# EAGLE design ADS124S08-Dev-Board (EAGLE 9.6.2)
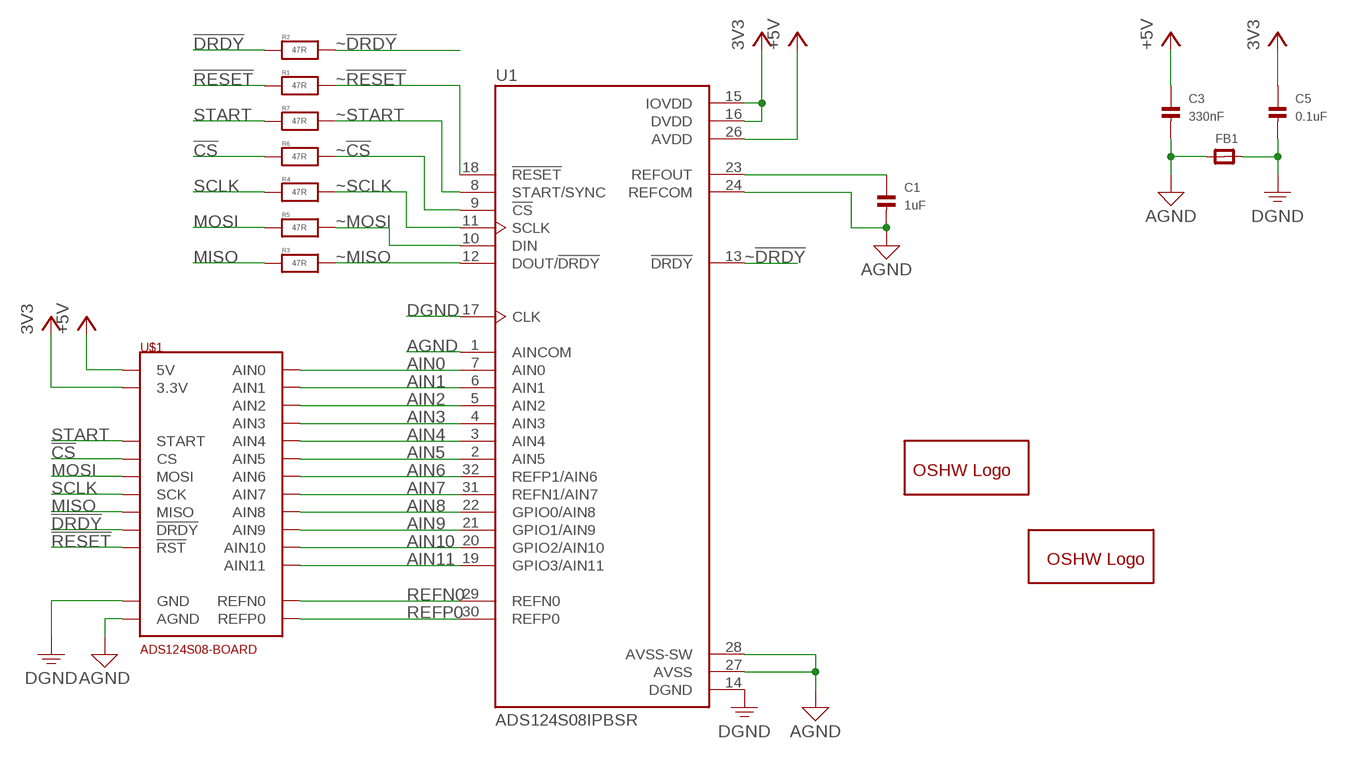
[diagram p0: schematic, sheet 1]

## Parts
C1  1uF  CAP_CERAMIC0603MINI  [C0603-MINI]
C3  330nF  CAP_CERAMIC0603MINI  [C0603-MINI]
C5  0.1uF  CAP_CERAMIC0603MINI  [C0603-MINI]
FB1  FERRITE_0603  [_0603]
GOLD_ORB_SM1  OSHWLOGOLOGO5MM  [OSHW_5MM]
GOLD_ORB_SM2  OSHWLOGOLOGO8MM  [OSHW_8MM]
R1  47R  RESISTOR0603MINI  [R0603-MINI]
R2  47R  RESISTOR0603MINI  [R0603-MINI]
R3  47R  RESISTOR0603MINI  [R0603-MINI]
R4  47R  RESISTOR0603MINI  [R0603-MINI]
R5  47R  RESISTOR0603MINI  [R0603-MINI]
R6  47R  RESISTOR0603MINI  [R0603-MINI]
R7  47R  RESISTOR0603MINI  [R0603-MINI]
U1  ADS124S08IPBSR  [QFP50P700X700X120-32N]
U$1  ADS124S08-BOARD  [ADS124S08-BOARD]

## Nets
3V3: C5.1 U1.15(IOVDD) U1.16(DVDD) U$1.15(3.3V)
!CS: R6.1 U$1.21(CS)
!DRDY: R2.1 U$1.17(!DRDY)
!RESET: R1.1 U$1.16(!RST)
+5V: C3.1 U1.26(AVDD) U$1.14(5V)
AGND: C1.2 C3.2 FB1.1 U1.1(AINCOM) U1.24(REFCOM) U1.27(AVSS) U1.28(AVSS-SW) U$1.25(AGND)
AIN0: U1.7(AIN0) U$1.12(AIN0)
AIN1: U1.6(AIN1) U$1.11(AIN1)
AIN2: U1.5(AIN2) U$1.10(AIN2)
AIN3: U1.4(AIN3) U$1.9(AIN3)
AIN4: U1.3(AIN4) U$1.8(AIN4)
AIN5: U1.2(AIN5) U$1.7(AIN5)
AIN6: U1.32(REFP1/AIN6) U$1.6(AIN6)
AIN7: U1.31(REFN1/AIN7) U$1.5(AIN7)
AIN8: U1.22(GPIO0/AIN8) U$1.4(AIN8)
AIN9: U1.21(GPIO1/AIN9) U$1.3(AIN9)
AIN10: U1.20(GPIO2/AIN10) U$1.2(AIN10)
AIN11: U1.19(GPIO3/AIN11) U$1.1(AIN11)
DGND: C5.2 FB1.2 U1.14(DGND) U1.17(CLK) U$1.13(GND) U$1.26(GND)
MISO: R3.1 U$1.18(MISO)
MOSI: R5.1 U$1.20(MOSI)
N$7: C1.1 U1.23(REFOUT)
REFN0: U1.29(REFN0) U$1.23(REFN0)
REFP0: U1.30(REFP0) U$1.24(REFP0)
SCLK: R4.1 U$1.19(SCK)
START: R7.1 U$1.22(START)
~!CS: R6.2 U1.9(!CS)
~!DRDY: R2.2 U1.13(!DRDY)
~!RESET: R1.2 U1.18(!RESET)
~MISO: R3.2 U1.12(DOUT/!DRDY)
~MOSI: R5.2 U1.10(DIN)
~SCLK: R4.2 U1.11(SCLK)
~START: R7.2 U1.8(START/SYNC)

## Library data of the parts
C1 C3 C5 = eventHorizon:CAP_CERAMIC: Ceramic Capacitors 0402 - 0402 Surface Mount Capacitors 16pF 50V 5% [Digikey: 445-4899-2-ND] 18pF 50V 5% [Digikey: 490-1281-2-ND] 22pF 50V 5% [Digikey: 490-1283-2-ND] 68pF 50V 5% [Digikey: 490-1289-2-ND] 0.1uF 10V 10% [Digikey: 490-1318-2-ND] 1.0uF 6.3V 10% [Digikey: 490-1320-2-ND] 0603 - 0603 Surface Mount Capacitors 16 pF 50V 5% [Digikey: 445-5051-2-ND] 22 pF 50V [Digikey: PCC220ACVTR-ND] 33 pF 50V 5% [Digikey: 490-1415-1-ND] 56pF 50V 5% [Digikey: 490-1421-1-ND] 220pF 50V 5% [Digikey: 445-1285-1-ND] 680 pF 50V 2200 pF 50V 5% C0G [Digikey: 445-1297-1-ND] 5600 pF 100V 5% X7R [Digikey: 478-3711-1-ND] 0.1 µF 25V 10% [Digikey: PCC2277TR-ND] 0.22 µF 16V 10% X7R [Digikey: 445-1318-1-ND] 1.0 µF 25V 10% [Digikey: 445-5146-2-ND] 0603 - RF Specific 3pF 250V +/-0.1pF RF [Digikey: 712-1347-1-ND] 18 pF 250V 5% [Digikey: 478-3505-1-ND or 712-1322-1-ND] 56 pF 250V 5% C0G RF [Digikey: 490-4867-1-ND] 68 pF 250V RF [Digikey: 490-4868-1-ND] 0805 - 0805 Surface Mount Capacitors 220 pF 250V 2% RF Ceramic Capacitor [Digikey: 712-1398-1-ND] 1000 pF 50V 2% NP0 Ceramic Capacitor [Digikey: 478-3760-1-ND] 0.1 µF 25V 10% Ceramic Capacitor [Digikey: PCC1828TR-ND] 1.0 µF 16V 10% Ceramic Capacitor[Digikey: 490-1691-2-ND] 10.0 µF 10V 10% Ceramic Capacitor[Digikey: 709-1228-1-ND] 10.0 uF 16V 10% Ceramic Capacitor [Digikey: 478-5165-2-ND] 47 uF 6.3V 20% Ceramic Capacitor [Digikey: 587-1779-1-ND or 399-5506-1-ND] 1206 - 1206 Surface Mount Capacitors 47uF 10V 20% Ceramic Capacitor [Digikey: 490-5528-1-ND or 399-5508-1-ND or 445-6010-1-ND] 100uF 6.3V -20%, +80% Y5V Ceramic Capacitor (Digikey: 490-4512-1-ND, Mouser: 81-GRM31CF50J107ZE1L); MF: AVX; MPN: 08055C104JAT2A; OC_FARNELL: 1740673
FB1 = electroShri:FERRITE: Ferrite Bead 0603 MMZ1608B121C - 120 Ohm @ 100MHz, 600mA, 0.15 Ohm DC Resistance - Digikey: 445-2164-1-ND BK1608HW121-T - 120 Ohm, 600mA Ferrite Chip - Digikey: 587-1876-2-ND 0805 HZ0805B272R-10 - 2.7K Ohm @ 100MHz, 200mA, 0.8 Ohm DC Resistance - Digikey: 240-2504-1-ND (see also Murata BLM21BD272SN1L) MMZ2012Y152B - 1.5K Ohm @ 100MHz, 500mA, 0.4 Ohm DC Resistance - Digikey: 445-1560-1-ND - Mainly for high frequency (80-400MHz) MMZ2012R102A - 1K Ohm @ 100MHz, 500mA, 0.3 Ohm DC Resistance - Digikey: 445-1555-2-ND - More general purpose (10-200MHz)
GOLD_ORB_SM1 GOLD_ORB_SM2 = electroShri:OSHWLOGO: The OSHW logo for PCB layout
R1-R7 = eventHorizon:RESISTOR: Resistors 0402 - 0402 Surface Mount Package 22 Ohm 1% 1/16W [Digikey: 311-22.0LRTR-ND] 33 Ohm 5% 1/16W 1.0K 5% 1/16W 1.5K 5% 1/16W 2.0K 1% 1/16W 10.0K 1% 1/16W [Digikey: 311-10.0KLRTR-ND] 10.0K 5% 1/16W [Digikey: RMCF0402JT10K0TR-ND] 12.1K 1% 1/16W [Digikey: 311-22.0LRTR-ND] 100.0K 5% 1/16W 0603 - 0603 Surface Mount Package 0 Ohm 1/10 Watt 1% Resistor 15 Ohm 1/10 Watt 1% Resistor 33 Ohm 1/10 Watt 1% Resistor 49.9 Ohm 1/10 Watt 1% Resistor 100 Ohm 1/10 Watt 1% Resistor 150 Ohm 1/10 Watt 1% Resistor 240 Ohm 1/10 Watt 1% Resistor 390 Ohm 1/10 Watt 1% Resistor 560 Ohm 1/10 Watt 1% Resistor 680 Ohm 1/10 Watt 1% Resistor 750 Ohm 1/10 Watt 1% Resistor 1.0K Ohm 1/10 Watt 1% Resistor 1.5K Ohm 1/10 Watt 1% Resistor 2.0K Ohm 1/10 Watt 1% Resistor 2.2K Ohm 1/10 Watt 1% Resistor 3.3K Ohm 1/10 Watt 1% Resistor 4.7K Ohm 1/10 Watt 1% Resistor 10.0K Ohm 1/10 Watt 1% Resistor 12.0K Ohm 1/10 Watt 1% Resistor 12.1K Ohm 1/10 Watt 1% Resistor 20.0K Ohm 1/10 Watt 1% Resistor 33.0K Ohm 1/10 Watt 1% Resistor 100.0K Ohm 1/10 Watt 1% Resistor 0805 - 0805 Surface Mount Package 0 Ohm 1/8 Watt 1% Resistor 33 Ohm 1/8 Watt 1% Resistor 100 Ohm 1/8 Watt 1% Resistor 150 Ohm 1/8 Watt 1% Resistor 200 Ohm 1/8 Watt 1% Resistor 240 Ohm 1/8 Watt 1% Resistor 330 Ohm 1/8 Watt 1% Resistor 390 Ohm 1/8 Watt 1% Resistor 470 Ohm 1/8 Watt 1% Resistor 1.0K Ohm 1/8 Watt 1% Resistor 1.5K Ohm 1/8 Watt 1% Resistor 2.0K Ohm 1/8 Watt 1% Resistor 4.7K Ohm 1/8 Watt 1% Resistor 5.1K Ohm 1/8 Watt 1% Resistor 5.6K Ohm 1/8 Watt 1% Resistor 10.0K Ohm 1/8 Watt 1% Resistor 22.0K Ohm 1/8 Watt 1% Resistor 33.0K Ohm 1/8 Watt 1% Resistor 100K Ohm 1/8 Watt 1% Resistor 1206 - 1206 Surface Mount Package 2012 - 2010 Surface Mount Package 0.11 Ohm 1/2 Watt 1% Resistor - Digikey: RHM.11UCT-ND
U1 = electroShri:ADS124S08IPBSR: 24-Bit, 4kSPS, 12-Ch Delta-Sigma ADC With PGA and VREF for Precision Sensor Measurement 32-TQFP -50 to 125 Check prices <https://pricing.snapeda.com/search/part/ADS124S08IPBSR/?ref=eda>; AVAILABILITY: Good; DESCRIPTION: 24-bit, 4-kSPS, 12-ch delta-sigma ADC with PGA and voltage reference for sensor measurement 32-TQFP -50 to 125; MF: Texas Instruments; MP: ADS124S08IPBSR; PACKAGE: TQFP-32 Texas Instruments; PRICE: None; PURCHASE-URL: https://pricing.snapeda.com/search/part/ADS124S08IPBSR/?ref=eda
U$1 = electroShri:ADS124S08-BOARD

## Board
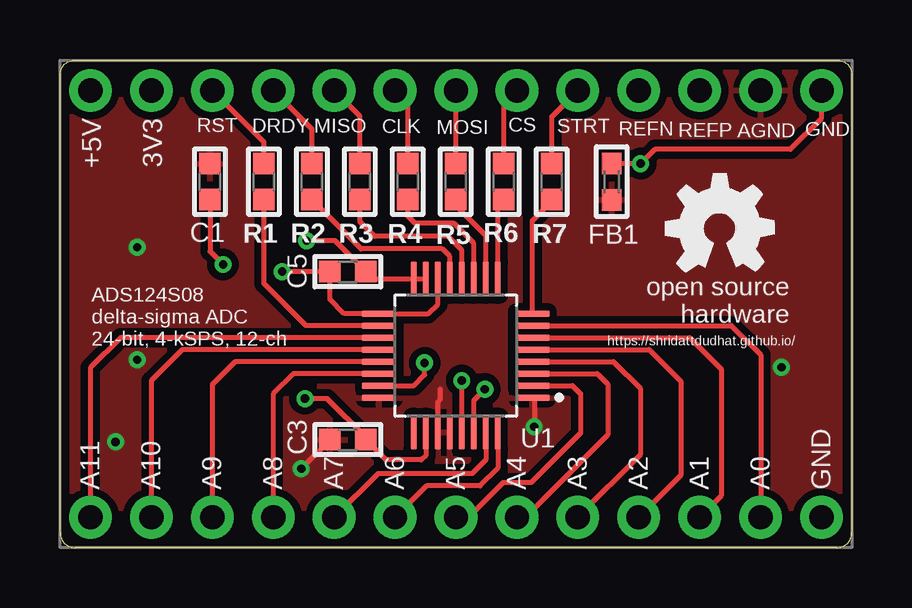
[diagram p1: board, top side]
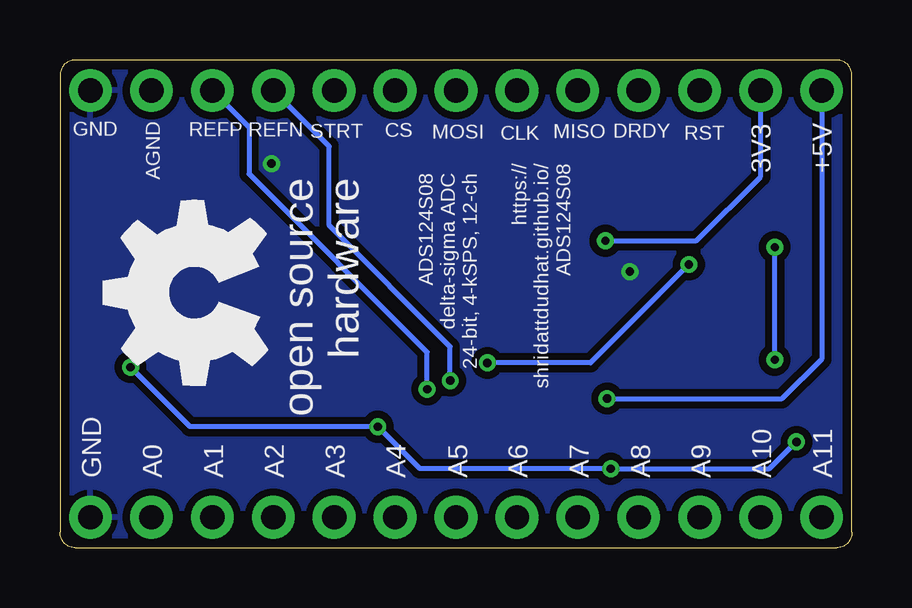
[diagram p2: board, bottom side, seen from below]

Size 33.02 x 20.32 mm. Coordinates in mm from the lower left corner, seen from the top.
Outline: 0,0.64 0,19.68 arc-90 0.64,20.32 32.38,20.32 arc-90 33.02,19.68 33.02,0.64 arc-90 32.38,0 0.64,0 arc-90 0,0.64
Copper layers (1*16): Top 0.035mm / dielectric 0.8mm / Bottom 0.035mm
Design rules "oizom": minimum track width 8mil, minimum drill 0.35mm, track to track 12mil, track to pad 12mil, pad to pad 12mil, via to via 12mil, smd to smd 8mil, copper to edge 15mil, drill to drill 12mil, minimum pad ring 7mil, minimum via ring 7mil, stop-mask expansion 4mil, vias tented up to drill 25mil, thermal gap 10mil

### Footprints (pad centres in the part's own frame; a part is rotated, then mirrored left to right if it is on the bottom)
C0603-MINI = smd 0.9 x 0.9: 1 -0.75,0; 2 0.75,0
_0603 = smd 0.9 x 0.8: 1 -0.762,0; 2 0.762,0
R0603-MINI = smd 0.9 x 0.9: 1 -0.75,0; 2 0.75,0
QFP50P700X700X120-32N = smd 1.44 x 0.26: 1 -3.195,1.75; 2 -3.195,1.25; 3 -3.195,0.75; 4 -3.195,0.25; 5 -3.195,-0.25; 6 -3.195,-0.75; 7 -3.195,-1.25; 8 -3.195,-1.75; 17 3.195,-1.75; 18 3.195,-1.25; 19 3.195,-0.75; 20 3.195,-0.25; 21 3.195,0.25; 22 3.195,0.75; 23 3.195,1.25; 24 3.195,1.75 | smd 0.26 x 1.44: 9 -1.75,-3.195; 10 -1.25,-3.195; 11 -0.75,-3.195; 12 -0.25,-3.195; 13 0.25,-3.195; 14 0.75,-3.195; 15 1.25,-3.195; 16 1.75,-3.195; 25 1.75,3.195; 26 1.25,3.195; 27 0.75,3.195; 28 0.25,3.195; 29 -0.25,3.195; 30 -0.75,3.195; 31 -1.25,3.195; 32 -1.75,3.195
ADS124S08-BOARD = drill 1.016 pad 1.778: 1 0,0; 2 2.54,0; 3 5.08,0; 4 7.62,0; 5 10.16,0; 6 12.7,0; 7 15.24,0; 8 17.78,0; 9 20.32,0; 10 22.86,0; 11 25.4,0; 12 27.94,0; 13 30.48,0; 14 0,17.78; 15 2.54,17.78; 16 5.08,17.78; 17 7.62,17.78; 18 10.16,17.78; 19 12.7,17.78; 20 15.24,17.78; 21 17.78,17.78; 22 20.32,17.78; 23 22.86,17.78; 24 25.4,17.78; 25 27.94,17.78; 26 30.48,17.78

### Placement (x,y rotation side)
C1  6.25,15.25 90 top
C3  12,4.5 180 top
C5  12,11.5 180 top
FB1  23,15.25 90 top
GOLD_ORB_SM1  27.5,13.3 0 top
GOLD_ORB_SM2  27.4,10.6 90 bottom
R1  8.5,15.25 270 top
R2  10.5,15.25 270 top
R3  12.5,15.25 270 top
R4  14.5,15.25 270 top
R5  16.5,15.25 270 top
R6  18.5,15.25 270 top
R7  20.5,15.25 270 top
U1  16.5,8 180 top
U$1  1.27,1.27 0 top

### Tracks (layer width: path | path; a pad name or v marks a point on that pad's centre or on a via)
3V3  (via drill 0.35)
  Top 0.203: U1.15 U1.16 13.05,11.2 C5.1 11.46,12.79 v10.28,12.79
  Bottom 0.203: v10.28,12.79 6.48,12.79 3.81,15.46 U$1.15
!CS
  Top 0.203: R6.1 18.5,18.5 U$1.21
!DRDY
  Top 0.203: R2.1 10.5,17.44 U$1.17
!RESET
  Top 0.203: R1.1 8.5,16.9 U$1.16
+5V  (via drill 0.35)
  Top 0.203: U1.26 15.25,3.84 15.07,3.66 13.59,3.66 C3.1 12.75,4.6 11.14,6.21 v10.21,6.21
  Bottom 0.203: U$1.14 1.27,7.86 2.92,6.21 v10.21,6.21
AGND  (via drill 0.35)
  Top 0.203: v19.77,5.04 19.77,6.17 U1.1 | C3.2 11.25,4.48 v10.06,3.29 | U1.27 15.75,6.07 15.86,6.18 15.86,6.61
  Bottom 0.203: v30.08,7.52 27.6,5.04 v19.77,5.04 18.02,3.29 v10.06,3.29 3.44,3.29 v2.32,4.41 | v3.22,7.83 v3.22,12.52
  pour Top (isolate 0.254): -1,-1 -1,21.68 33.9,21.68 33.9,-1
AIN0
  Top 0.203: U1.7 27.99,9.25 29.21,8.03 U$1.12
AIN1
  Top 0.203: U1.6 26.26,8.75 27.57,7.44 27.57,2.17 U$1.11
AIN2
  Top 0.203: U1.5 24.57,8.25 25.88,6.94 25.88,3.02 U$1.10
AIN3
  Top 0.203: U1.4 23.08,7.75 24.19,6.64 24.19,3.88 U$1.9
AIN4
  Top 0.203: U1.3 22.4,7.25 22.84,6.81 22.84,4.71 19.4,1.27 U$1.8
AIN5
  Top 0.203: U1.2 21.37,6.75 21.7,6.42 21.7,4.77 19.64,2.71 18.47,2.71 17.03,1.27 U$1.7
AIN6
  Top 0.203: U$1.6 15.28,2.58 17.51,2.58 18.25,3.32 U1.32
AIN7
  Top 0.203: U1.31 17.75,3.66 17.18,3.09 13.25,3.09 U$1.5
AIN8
  Top 0.203: U1.22 9.73,7.25 8.89,6.41 U$1.4
AIN9
  Top 0.203: U1.21 7.31,7.75 6.35,6.79 U$1.3
AIN10
  Top 0.203: U1.20 5.1,8.25 3.81,6.96 U$1.2
AIN11
  Top 0.203: U1.19 2.53,8.75 1.27,7.49 U$1.1
DGND  (via drill 0.35)
  Top 0.203: v9.26,11.5 C5.2 11.25,10.35 11.85,9.75 U1.17 15.35,9.75 15.75,10.15 U1.14 | FB1.2 24.19,16.01 v24.2,16 24.8,16.6 30.45,16.6 31.75,17.9 U$1.26
  pour Bottom (isolate 0.254): -2,-2 -2,22.68 34.9,22.68 34.9,-2
MISO
  Top 0.203: R3.1 12.5,17.98 U$1.18
MOSI
  Top 0.203: R5.1 U$1.20
N$7  (via drill 0.35)
  Top 0.203: C1.1 6.25,12.35 v6.8,11.8 | v15.2,7.7 15.2,7.2 14.75,6.75 U1.23
  Bottom 0.203: v6.8,11.8 10.9,7.7 v15.2,7.7
REFN0  (via drill 0.35)
  Top 0.203: U1.29 v16.75,6.96
  Bottom 0.203: v16.75,6.96 16.75,8.38 21.8,13.43 21.8,16.72 U$1.23
REFP0  (via drill 0.35)
  Top 0.203: U1.30 17.25,6.14 v17.71,6.6
  Bottom 0.203: v17.71,6.6 17.71,8.15 25.14,15.58 25.14,17.52 U$1.24
SCLK
  Top 0.203: R4.1 14.5,18.52 U$1.19
START
  Top 0.203: R7.1 20.5,17.96 U$1.22
~!CS
  Top 0.203: U1.9 18.25,14.25 R6.2
~!DRDY
  Top 0.203: U1.13 16.25,12.14 15.94,12.45 12.55,12.45 R2.2
~!RESET
  Top 0.203: U1.18 10.25,9.25 8.5,11 R1.2
~MISO
  Top 0.203: U1.12 16.75,12.4 16.18,12.97 13.12,12.97 12.5,13.59 R3.2
~MOSI
  Top 0.203: U1.10 17.75,12.99 16.5,14.24 R5.2
~SCLK
  Top 0.203: U1.11 17.25,12.68 16.42,13.51 14.81,13.51 14.5,13.82 R4.2
~START
  Top 0.203: U1.8 19.7,13.63 20.5,14.44 R7.2

### Text on the board
tPlace: +5V | 3V3 | RST | DRDY | MISO | CLK | MOSI | CS | STRT | REFN | REFP | AGND | GND | ADS124S08 / delta-sigma ADC / 24-bit, 4-kSPS, 12-ch | https://shridattdudhat.github.io/ | A11 | A10 | A9 | A8 | A7 | A6 | A5 | A4 | A3 | A2 | A1 | A0 | GND
bPlace: +5V | 3V3 | AGND | RST | DRDY | MISO | CLK | MOSI | CS | STRT | REFN | REFP | GND | https:// / shridattdudhat.github.io/ / ADS124S08 | ADS124S08 / delta-sigma ADC / 24-bit, 4-kSPS, 12-ch | A11 | A10 | A9 | A8 | A7 | A6 | A5 | A4 | A3 | A2 | A1 | A0 | GND